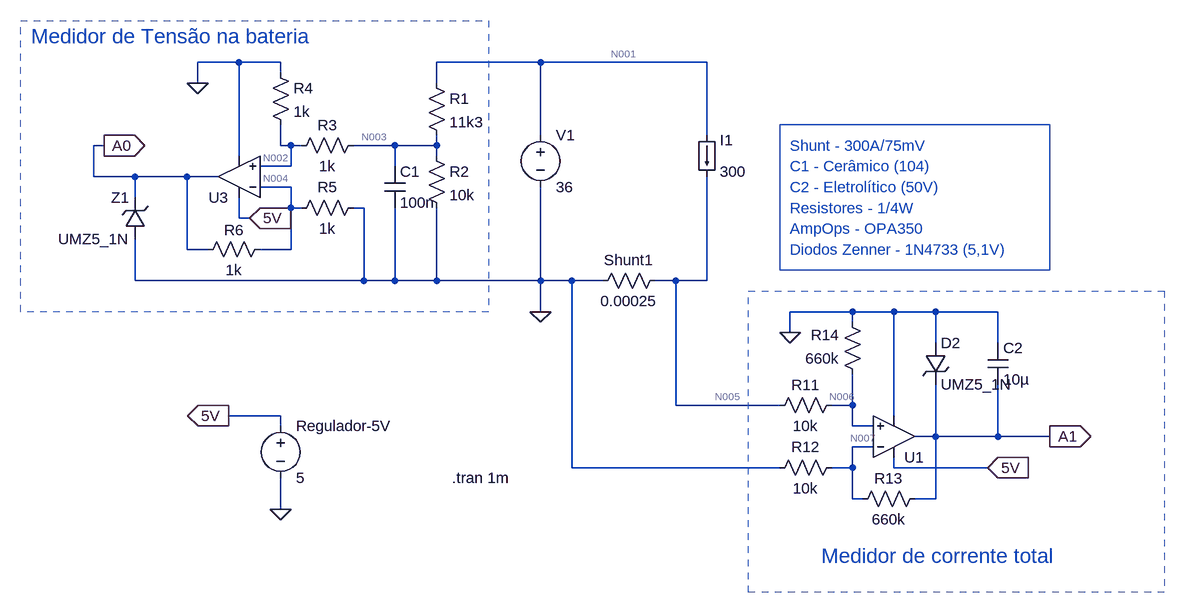
[diagram p0: schematic sensor.asc]
sensor.asc, the LTspice schematic file:
Version 4.1
SHEET 1 948 1076
WIRE -480 256 -544 256
WIRE -416 256 -480 256
WIRE -16 256 -176 256
WIRE 240 256 -16 256
WIRE -416 272 -416 256
WIRE -544 288 -544 256
WIRE -176 288 -176 256
WIRE -16 368 -16 256
WIRE 240 368 240 256
WIRE -688 384 -704 384
WIRE -416 384 -416 352
WIRE -400 384 -416 384
WIRE -384 384 -400 384
WIRE -240 384 -304 384
WIRE -176 384 -176 368
WIRE -176 384 -240 384
WIRE -480 400 -480 256
WIRE -176 400 -176 384
WIRE -400 416 -400 384
WIRE -400 416 -448 416
WIRE -240 416 -240 384
WIRE -704 432 -704 384
WIRE -640 432 -704 432
WIRE -560 432 -640 432
WIRE -512 432 -560 432
WIRE -400 448 -448 448
WIRE -640 464 -640 432
WIRE -400 480 -400 448
WIRE -384 480 -400 480
WIRE -288 480 -304 480
WIRE -480 496 -480 464
WIRE -464 496 -480 496
WIRE -560 544 -560 432
WIRE -528 544 -560 544
WIRE -400 544 -400 480
WIRE -400 544 -448 544
WIRE -640 592 -640 528
WIRE -288 592 -288 480
WIRE -288 592 -640 592
WIRE -240 592 -240 480
WIRE -240 592 -288 592
WIRE -176 592 -176 480
WIRE -176 592 -240 592
WIRE -16 592 -16 448
WIRE -16 592 -176 592
WIRE 32 592 -16 592
WIRE 80 592 32 592
WIRE 192 592 160 592
WIRE 240 592 240 432
WIRE 240 592 192 592
WIRE -16 640 -16 592
WIRE 464 640 368 640
WIRE 528 640 464 640
WIRE 592 640 528 640
WIRE 688 640 592 640
WIRE 464 656 464 640
WIRE 368 672 368 640
WIRE 592 688 592 640
WIRE 688 688 688 640
WIRE 192 784 192 592
WIRE 352 784 192 784
WIRE 464 784 464 736
WIRE 464 784 432 784
WIRE -416 800 -496 800
WIRE 528 800 528 640
WIRE -416 816 -416 800
WIRE 464 816 464 784
WIRE 496 816 464 816
WIRE 592 832 592 752
WIRE 592 832 560 832
WIRE 688 832 688 752
WIRE 688 832 592 832
WIRE 768 832 688 832
WIRE 496 848 464 848
WIRE 32 880 32 592
WIRE 352 880 32 880
WIRE 464 880 464 848
WIRE 464 880 432 880
WIRE 528 880 528 864
WIRE 672 880 528 880
WIRE 464 928 464 880
WIRE 480 928 464 928
WIRE 592 928 592 832
WIRE 592 928 560 928
WIRE -416 944 -416 896
FLAG -16 640 0
FLAG -688 384 A0
IOPIN -688 384 Out
FLAG -544 288 0
FLAG -464 496 5V
IOPIN -464 496 In
FLAG -416 944 0
FLAG -496 800 5V
IOPIN -496 800 Out
FLAG 368 672 0
FLAG 768 832 A1
IOPIN 768 832 Out
FLAG 672 880 5V
IOPIN 672 880 In
SYMBOL voltage -16 352 R0
WINDOW 123 0 0 Left 0
WINDOW 39 0 0 Left 0
SYMATTR InstName V1
SYMATTR Value 36
SYMBOL res -192 384 R0
SYMATTR InstName R2
SYMATTR Value 10k
SYMBOL res -192 272 R0
SYMATTR InstName R1
SYMATTR Value 11k3
SYMBOL res -288 368 R90
WINDOW 0 0 56 VBottom 2
WINDOW 3 32 56 VTop 2
SYMATTR InstName R3
SYMATTR Value 1k
SYMBOL res -288 464 R90
WINDOW 0 0 56 VBottom 2
WINDOW 3 32 56 VTop 2
SYMATTR InstName R5
SYMATTR Value 1k
SYMBOL cap -256 416 R0
SYMATTR InstName C1
SYMATTR Value 100n
SYMBOL res -432 528 R90
WINDOW 0 -14 71 VLeft 2
WINDOW 3 32 56 VTop 2
SYMATTR InstName R6
SYMATTR Value 1k
SYMBOL zener -624 528 R180
WINDOW 0 24 64 Left 2
WINDOW 3 24 0 Left 2
SYMATTR InstName Z1
SYMATTR Value UMZ5_1N
SYMATTR Description Diode
SYMATTR Type diode
SYMBOL res -432 256 R0
SYMATTR InstName R4
SYMATTR Value 1k
SYMBOL OpAmps\\UniversalOpAmp -480 432 R180
SYMATTR InstName U3
SYMBOL voltage -416 800 R0
WINDOW 123 0 0 Left 0
WINDOW 39 0 0 Left 0
SYMATTR InstName Regulador-5V
SYMATTR Value 5
SYMBOL res 176 576 R90
WINDOW 0 0 56 VBottom 2
WINDOW 3 32 56 VTop 2
SYMATTR InstName Shunt1
SYMATTR Value 0.00025
SYMBOL res 448 768 R90
WINDOW 0 0 56 VBottom 2
WINDOW 3 32 56 VTop 2
SYMATTR InstName R11
SYMATTR Value 10k
SYMBOL res 448 864 R90
WINDOW 0 0 56 VBottom 2
WINDOW 3 32 56 VTop 2
SYMATTR InstName R12
SYMATTR Value 10k
SYMBOL res 576 912 R90
WINDOW 0 0 56 VBottom 2
WINDOW 3 32 56 VTop 2
SYMATTR InstName R13
SYMATTR Value 660k
SYMBOL res 480 752 R180
WINDOW 0 36 76 Left 2
WINDOW 3 36 40 Left 2
SYMATTR InstName R14
SYMATTR Value 660k
SYMBOL cap 672 688 R0
SYMATTR InstName C2
SYMATTR Value 10µ
SYMBOL zener 576 688 R0
SYMATTR InstName D2
SYMATTR Value UMZ5_1N
SYMATTR Description Diode
SYMATTR Type diode
SYMBOL OpAmps\\UniversalOpAmp 528 832 M180
SYMATTR InstName U1
SYMBOL load 224 368 R0
WINDOW 123 0 0 Left 0
WINDOW 39 0 0 Left 0
SYMATTR InstName I1
SYMATTR Value 300
TEXT -800 216 Left 3 ;Medidor de Tensão na bateria
TEXT 416 1016 Left 3 ;Medidor de corrente total
TEXT -152 896 Left 2 !.tran 1m
TEXT 368 384 Left 2 ;Shunt - 300A/75mV
TEXT 368 416 Left 2 ;C1 - Cerâmico (104)
TEXT 368 448 Left 2 ;C2 - Eletrolítico (50V)
TEXT 368 480 Left 2 ;Resistores - 1/4W
TEXT 368 512 Left 2 ;AmpOps - OPA350
TEXT 368 544 Left 2 ;Diodos Zenner - 1N4733 (5,1V)
RECTANGLE Normal -96 640 -816 192 2
RECTANGLE Normal 944 1072 304 608 2
RECTANGLE Normal 768 576 352 352

The netlist it stands for:
* sensor.asc
V1 N001 0 36
R2 N003 0 10k
R1 N001 N003 11k3
R3 N003 N002 1k
R5 0 N004 1k
C1 N003 0 100n
R6 N004 A0 1k
D§Z1 0 A0 UMZ5_1N
R4 0 N002 1k
X§U3 N002 N004 5V 0 A0 level1 Avol=1Meg GBW=10Meg Vos=0 En=0 Enk=0 In=0 Ink=0 Rin=500Meg  ; pins In+ In- V+ V- OUT
V§Regulador-5V 5V 0 5
R§Shunt1 N005 0 0.00025
R11 N006 N005 10k
R12 N007 0 10k
R13 A1 N007 660k
R14 N006 0 660k
C2 0 A1 10µ
D2 0 A1 UMZ5_1N
X§U1 N006 N007 5V 0 A1 level1 Avol=1Meg GBW=10Meg Vos=0 En=0 Enk=0 In=0 Ink=0 Rin=500Meg  ; pins In+ In- V+ V- OUT
I1 N001 N005 300
.model D D
.lib standard.dio
* Medidor de Tensão na bateria
* Medidor de corrente total
.tran 1m
* Shunt - 300A/75mV
* C1 - Cerâmico (104)
* C2 - Eletrolítico (50V)
* Resistores - 1/4W
* AmpOps - OPA350
* Diodos Zenner - 1N4733 (5,1V)
.lib UniversalOpAmp1.lib
.backanno
.end

* Results of the author's LTspice run, read from the files saved beside the schematic
* Operating Point, zero values left out:
*   V(5v) = 5 V
*   V(a0) = 4.627 V
*   V(a1) = 4.95 V
*   V(n001) = 36 V
*   V(n002) = 2.314 V
*   V(n003) = 4.627 V
*   V(n004) = 2.314 V
*   V(n005) = 75 mV
*   V(n006) = 73.93 mV
*   V(n007) = 73.92 mV
*   I(D2) = -211.2 µA
*   I(I1) = 300 A
*   I(R1) = 2.776 mA
*   I(R11) = -107.2 nA
*   I(R12) = 7.392 µA
*   I(R13) = 7.387 µA
*   I(R14) = 112 nA
*   I(R2) = 462.7 µA
*   I(R3) = 2.314 mA
*   I(R4) = -2.314 mA
*   I(R5) = -2.314 mA
*   I(R6) = -2.314 mA
*   I(Regulador-5V) = -15.22 nA
*   I(Shunt1) = 300 A
*   I(V1) = -300 A
*   I(Z1) = -48.74 µA
*   Ix(u1:1) = -4.852 nA
*   Ix(u1:2) = -4.852 nA
*   Ix(u1:3) = 9.852 nA
*   Ix(u1:4) = -147.9 pA
*   Ix(u1:5) = -218.6 µA
*   Ix(u3:1) = -372.7 pA
*   Ix(u3:2) = -372.8 pA
*   Ix(u3:3) = 5.373 nA
*   Ix(u3:4) = -4.627 nA
*   Ix(u3:5) = -2.362 mA
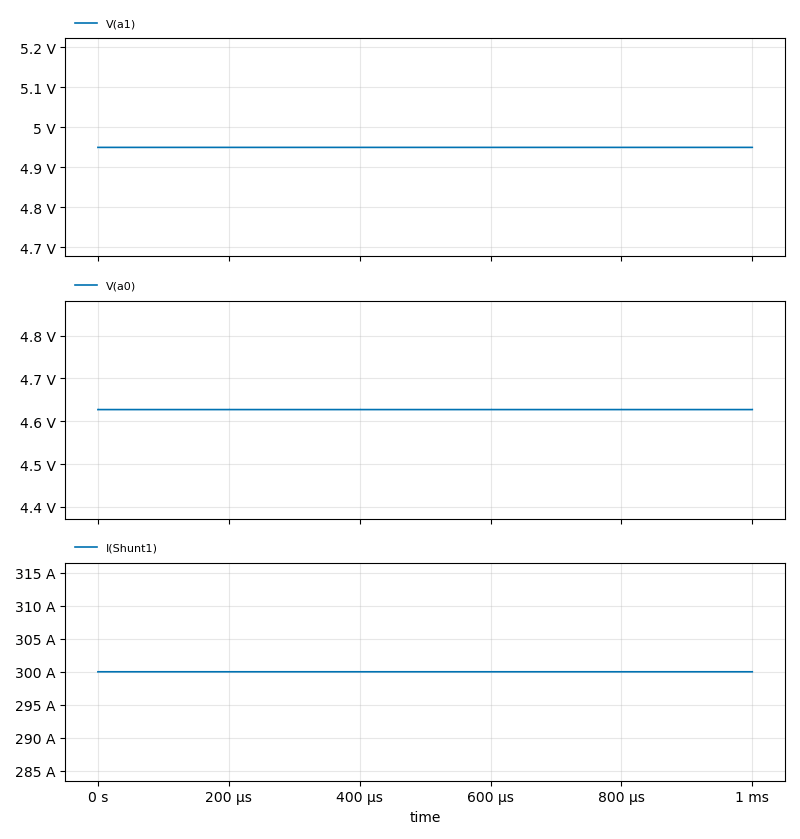
[diagram p1: Transient Analysis of sensor.asc, plotted from the saved traces]
* Transient Analysis, 1 run:
*   V(a1): min 4.95 V, max 4.95 V, average 4.95 V, rms 4.95 V, last 4.95 V
*   V(a0): min 4.627 V, max 4.627 V, average 4.627 V, rms 4.627 V, last 4.627 V
*   I(Shunt1): min 300 A, max 300 A, average 300 A, rms 300 A, last 300 A